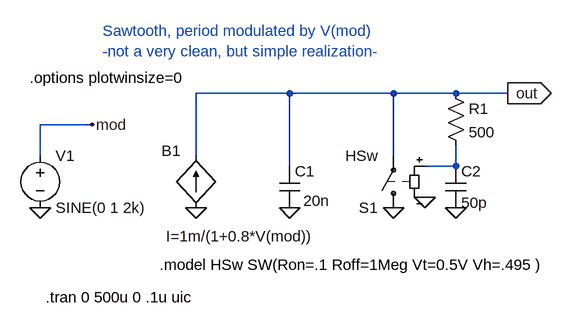
[diagram p0: schematic modulated_sawtooth1.asc]
modulated_sawtooth1.asc, the LTspice schematic file:
Version 4
SHEET 1 880 680
WIRE -288 176 -288 128
WIRE -208 128 -288 128
WIRE -48 176 -48 80
WIRE 96 80 -48 80
WIRE 96 192 96 80
WIRE 256 80 96 80
WIRE 256 176 256 80
WIRE 352 80 256 80
WIRE 352 192 304 192
WIRE 352 192 352 160
WIRE 432 80 352 80
FLAG 96 256 0
FLAG -48 256 0
FLAG 432 80 out
IOPIN 432 80 Out
FLAG 256 256 0
FLAG 304 240 0
FLAG 352 256 0
FLAG -288 256 0
FLAG -208 128 mod
SYMBOL cap 80 192 R0
WINDOW 3 37 53 Left 0
SYMATTR Value 20n
SYMATTR InstName C1
SYMBOL bi -48 256 R180
WINDOW 0 24 88 Left 0
WINDOW 3 -182 -44 Left 0
SYMATTR InstName B1
SYMATTR Value I=1m/(1+0.8*V(mod))
SYMBOL sw 256 272 R180
SYMATTR InstName S1
SYMATTR Value HSw
SYMBOL res 336 64 R0
SYMATTR InstName R1
SYMATTR Value 500
SYMBOL cap 336 192 R0
SYMATTR InstName C2
SYMATTR Value 50p
SYMBOL voltage -288 160 R0
WINDOW 123 0 0 Left 0
WINDOW 39 0 0 Left 0
SYMATTR InstName V1
SYMATTR Value SINE(0 1 2k)
TEXT -280 394 Left 0 !.tran 0 500u 0 .1u uic
TEXT -104 344 Left 0 !.model HSw SW(Ron=.1 Roff=1Meg Vt=0.5V Vh=.495 )
TEXT -192 -16 Left 0 ;Sawtooth, period modulated by V(mod)\n-not a very clean, but simple realization-
TEXT -304 56 Left 0 !.options plotwinsize=0

The netlist it stands for:
* modulated_sawtooth1.asc
C1 out 0 20n
B1 0 out I=1m/(1+0.8*V(mod))
S1 0 out N001 0 HSw
R1 out N001 500
C2 N001 0 50p
V1 mod 0 SINE(0 1 2k)
.tran 0 500u 0 .1u uic
.model HSw SW(Ron=.1 Roff=1Meg Vt=0.5V Vh=.495 )
* Sawtooth, period modulated by V(mod)
* -not a very clean, but simple realization-
.options plotwinsize=0
.backanno
.end